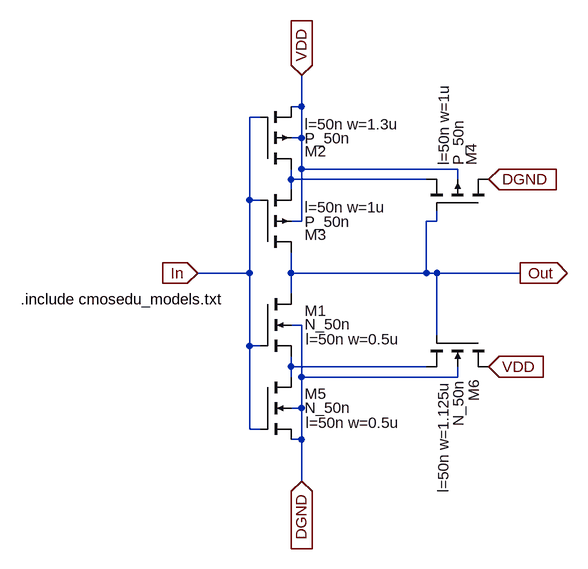
[diagram p0: schematic Schmitt_Trigger.asc]
Schmitt_Trigger.asc, the LTspice schematic file:
Version 4
SHEET 1 1168 756
WIRE 192 32 192 -16
WIRE 192 32 176 32
WIRE 128 48 112 48
WIRE 192 80 192 32
WIRE 192 80 176 80
WIRE 192 128 192 80
WIRE 432 128 192 128
WIRE 176 144 176 128
WIRE 384 144 176 144
WIRE 432 144 432 128
WIRE 176 160 176 144
WIRE 112 176 112 48
WIRE 128 176 112 176
WIRE 192 208 192 128
WIRE 192 208 176 208
WIRE 400 208 400 192
WIRE 400 208 384 208
WIRE 112 288 112 176
WIRE 112 288 32 288
WIRE 176 288 176 256
WIRE 384 288 384 208
WIRE 384 288 176 288
WIRE 400 288 384 288
WIRE 528 288 400 288
WIRE 176 320 176 288
WIRE 192 368 176 368
WIRE 400 384 400 288
WIRE 112 400 112 288
WIRE 128 400 112 400
WIRE 176 432 176 416
WIRE 384 432 176 432
WIRE 176 448 176 432
WIRE 192 448 192 368
WIRE 432 448 432 432
WIRE 432 448 192 448
WIRE 192 496 192 448
WIRE 192 496 176 496
WIRE 112 528 112 400
WIRE 128 528 112 528
WIRE 192 544 192 496
WIRE 192 544 176 544
WIRE 192 608 192 544
FLAG 192 -16 VDD
IOPIN 192 -16 In
FLAG 32 288 In
IOPIN 32 288 In
FLAG 528 288 Out
IOPIN 528 288 Out
FLAG 192 608 DGND
IOPIN 192 608 In
FLAG 480 432 VDD
IOPIN 480 432 In
FLAG 480 144 DGND
IOPIN 480 144 In
SYMBOL nmos4 128 320 R0
WINDOW 0 69 26 Left 2
WINDOW 3 69 47 Left 2
WINDOW 123 70 70 Left 2
SYMATTR InstName M1
SYMATTR Value N_50n
SYMATTR Value2 l=50n w=0.5u
SYMBOL pmos4 128 128 M180
WINDOW 0 69 27 Left 2
WINDOW 3 69 47 Left 2
WINDOW 123 69 69 Left 2
SYMATTR InstName M2
SYMATTR Value P_50n
SYMATTR Value2 l=50n w=1.3u
SYMBOL pmos4 128 256 M180
WINDOW 0 69 27 Left 2
WINDOW 3 69 47 Left 2
WINDOW 123 69 69 Left 2
SYMATTR InstName M3
SYMATTR Value P_50n
SYMATTR Value2 l=50n w=1u
SYMBOL pmos4 480 192 M270
WINDOW 0 69 27 Left 2
WINDOW 3 69 47 Left 2
WINDOW 123 69 69 Left 2
SYMATTR InstName M4
SYMATTR Value P_50n
SYMATTR Value2 l=50n w=1u
SYMBOL nmos4 128 448 R0
WINDOW 0 69 26 Left 2
WINDOW 3 69 47 Left 2
WINDOW 123 70 70 Left 2
SYMATTR InstName M5
SYMATTR Value N_50n
SYMATTR Value2 l=50n w=0.5u
SYMBOL nmos4 480 384 R90
WINDOW 0 68 23 Left 2
WINDOW 3 69 47 Left 2
WINDOW 123 70 70 Left 2
SYMATTR InstName M6
SYMATTR Value N_50n
SYMATTR Value2 l=50n w=1.125u
TEXT -240 328 Left 2 !.include cmosedu_models.txt

The netlist it stands for:
* Schmitt_Trigger.asc
M1 Out In N002 DGND N_50n l=50n w=0.5u
M2 N001 In VDD VDD P_50n l=50n w=1.3u
M3 Out In N001 VDD P_50n l=50n w=1u
M4 DGND Out N001 VDD P_50n l=50n w=1u
M5 N002 In DGND DGND N_50n l=50n w=0.5u
M6 VDD Out N002 DGND N_50n l=50n w=1.125u
.model NMOS NMOS
.model PMOS PMOS
.lib standard.mos
.include cmosedu_models.txt
.backanno
.end